# Altium schematic sheet Power.SchDoc
size A
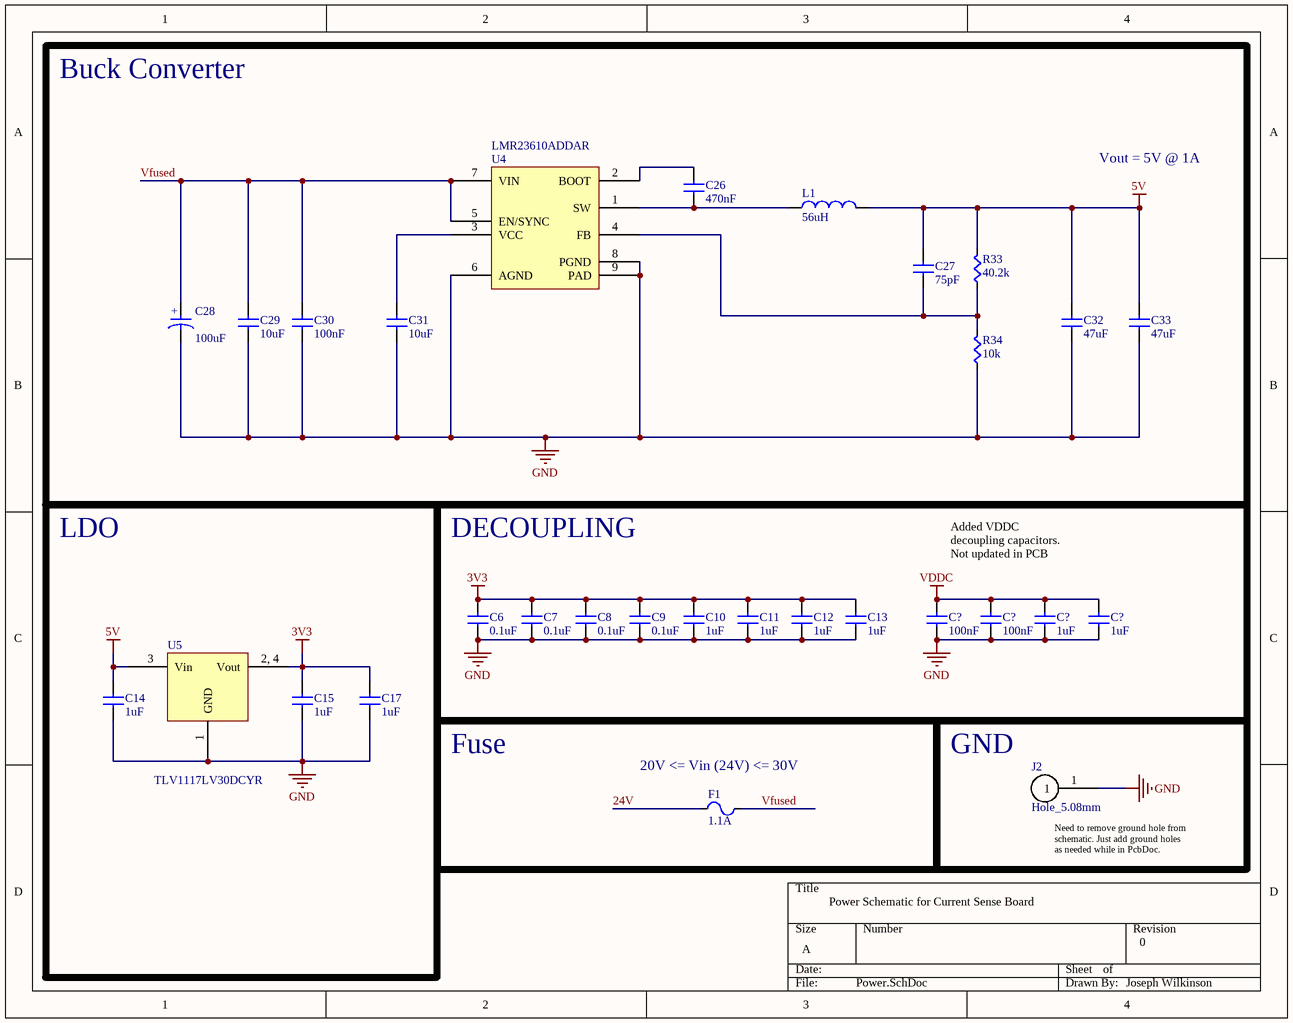
[diagram p0: Power.SchDoc]

## Parts
(Parts that share a designator on the sheet are numbered #1, #2 ... from top to bottom, then left to right.)
C6  value 0.1uF  [CAPC0603]  (hidden comment: Cap)
C7  value 0.1uF  [CAPC0603]  (hidden comment: Cap)
C8  value 0.1uF  [CAPC0603]  (hidden comment: Cap)
C9  value 0.1uF  [CAPC0603]  (hidden comment: Cap)
C10  value 1uF  [CAPC0603]  (hidden comment: Cap)
C11  value 1uF  [CAPC0603]  (hidden comment: Cap)
C12  value 1uF  [CAPC0603]  (hidden comment: Cap)
C13  value 1uF  [CAPC0603]  (hidden comment: Cap)
C14  value 1uF  [CAPC0603]  (hidden comment: Cap)
C15  value 1uF  [CAPC0603]  (hidden comment: Cap)
C17  value 1uF  [CAPC0603]  (hidden comment: Cap)
C26  value 470nF  [CAPC0603]  (hidden comment: Cap)
C27  value 75pF  [CAPC0603]  (hidden comment: Cap)
C28  value 100uF  [MAL215097101E3]  (hidden comment: MAL215097101E3)
C29  value 10uF  [CAPC1206]  (hidden comment: Cap)
C30  value 100nF  [CAPC0603]  (hidden comment: Cap)
C31  value 10uF  [CAPC1206]  (hidden comment: Cap)
C32  value 47uF  [CAP1210]  (hidden comment: Cap)
C33  value 47uF  [CAP1210]  (hidden comment: Cap)
C?#1  value 100nF  [CAPC0603]  (hidden comment: Cap)
C?#2  value 100nF  [CAPC0603]  (hidden comment: Cap)
C?#3  value 1uF  [CAPC0603]  (hidden comment: Cap)
C?#4  value 1uF  [CAPC0603]  (hidden comment: Cap)
F1  value 1.1A  [PTC7451X11N]  (hidden comment: PTC Fuse)
J2  Hole_5.08mm  [HOLE_5_08mm]
L1  value 56uH  [MSS1048-563MLB]  (hidden comment: MSS1048-563MLB)
R33  value 40.2k  [RES0603]  (hidden comment: Res)
R34  value 10k  [RES0603]  (hidden comment: Res)
U4  LMR23610ADDAR  [LMR23610ADDAR]
U5  TLV1117LV30DCYR  [SOT23-4N]

## Blocks framed on the sheet
Buck Converter: C26-C33 L1 R33 R34 U4
LDO: C14 C15 C17 U5
DECOUPLING: C6-C13 C?#1-C?#4
Fuse: F1
GND: J2

## Nets
3V3: C6.1(A) C7.1(A) C8.1(A) C9.1(A) C10.1(A) C11.1(A) C12.1(A) C13.1(A) C15.1(A) C17.1(A) U5.2,_4(Vout)
5V: C14.1(A) C27.1(A) C32.1(A) C33.1(A) L1.2 R33.1(A) U5.3(Vin)
GND: C6.2(B) C7.2(B) C8.2(B) C9.2(B) C10.2(B) C11.2(B) C12.2(B) C13.2(B) C14.2(B) C15.2(B) C17.2(B) C28.2 C29.2(B) C30.2(B) C31.2(B) C32.2(B) C33.2(B) C?#1.2(B) C?#2.2(B) C?#3.2(B) C?#4.2(B) J2.1 R34.2(B) U4.6(AGND) U4.8(PGND) U4.9(PAD) U5.1(GND)
VDDC: C?#1.1(A) C?#2.1(A) C?#3.1(A) C?#4.1(A)
24V: F1.1(A)
Vfused: C28.1 C29.1(A) C30.1(A) F1.2(B) U4.5(EN/SYNC) U4.7(VIN)
NetC26_1: C26.1(A) U4.2(BOOT)
NetC26_2: C26.2(B) L1.1 U4.1(SW)
NetC27_2: C27.2(B) R33.2(B) R34.1(A) U4.4(FB)
NetC31_1: C31.1(A) U4.3(VCC)

## Notes on the sheet
- Vout = 5V @ 1A
- Added VDDC decoupling capacitors. Not updated in PCB document.
- (near F1) 20V <= Vin (24V) <= 30V
- Power Schematic for Current Sense Board
- (near J2) Need to remove ground hole from schematic. Just add ground holes as needed while in PcbDoc.
- 0
- Joseph Wilkinson
- (in symbol MAL215097101E3) +

## Library data of the parts
F1 = PTC_Fuse: Supplier 1: Digi-Key; Supplier Part Number 1: 507-1744-1-ND
L1 = MSS1048-563MLB: FIXED IND 56UH 1.7A 126 MOHM; Manufacturer 1: Coilcraft; Manufacturer Part Number 1: MSS1048-563MLB; ComponentLink1Description: Web Site; ComponentLink1URL: https://www.coilcraft.com/mss1048.cfm; Supplier 1: Coilcraft; Supplier Part Number 1: MSS1048-563MLB
U4 = LMR23610ADDAR: IC REG BUCK ADJ 1A SYNC 8SOPWRPD; Manufacturer 1: Texas Instruments; Supplier 1: Digi-Key; Supplier Part Number 1: 296-47267-1-ND; Manufacturer Part Number 1: LMR23610ADDAR; ComponentLink1URL: http://www.ti.com/lit/ds/symlink/lmr23610.pdf; ComponentLink1Description: Datasheet; ComponentLink2URL: http://www.ti.com/product/LMR23610/description; ComponentLink2Description: Web Site
C6-C15 C17 C26 C27 C29-C33 C?#1-C?#4 = Cap: Supplier 1: Digi-Key
  C6-C15 C17 C30 C?#1-C?#4: Supplier Part Number 1: 1276-1000-1-ND
  C32 C33: Supplier Part Number 1: 490-6538-1-ND
R33 R34 = Res: Supplier 1: Digi-Key; Supplier Part Number 1: RMCF0603JT10K0CT-ND